# Altium schematic sheet ATMEGA32U4+Micro+Ver1.0.schdoc
size 305 x 221 mm
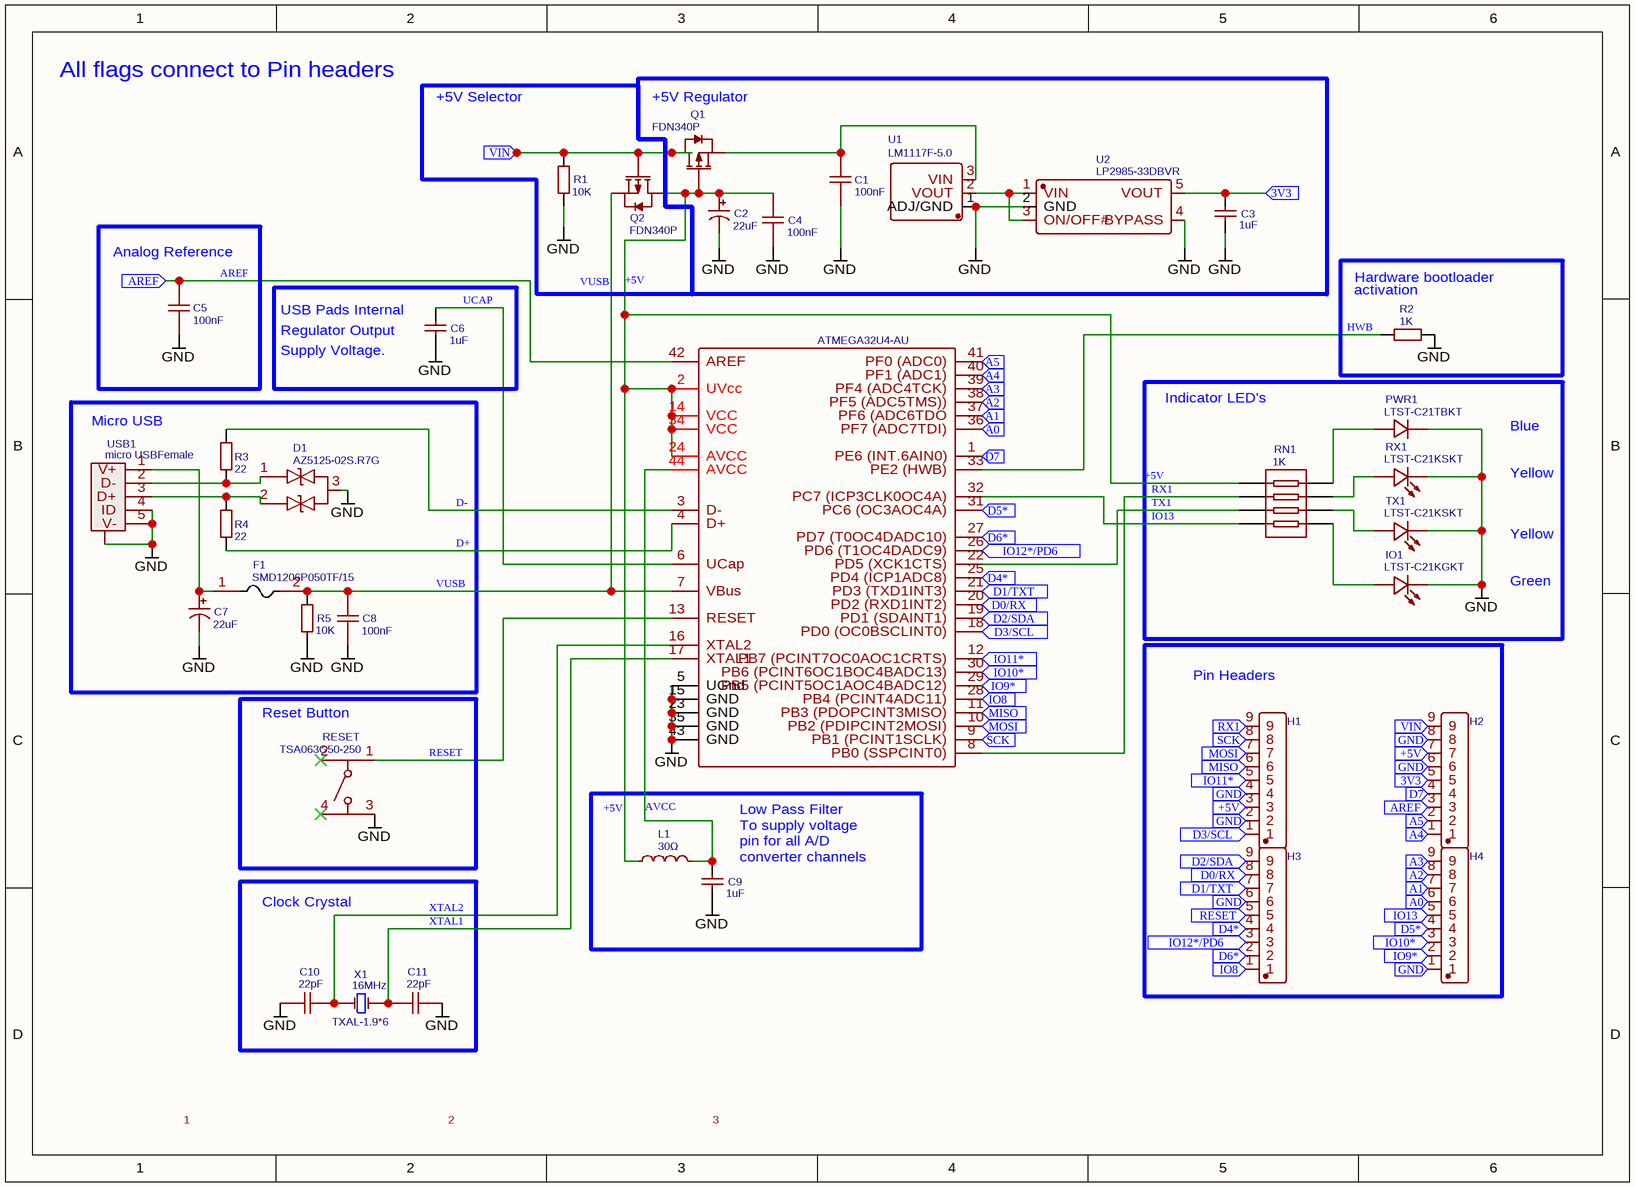
[diagram p0: ATMEGA32U4+Micro+Ver1.0.schdoc]

## Parts
ATMEGA1U4-AU  ATMEGA32U4-AU  [QFP-44_10X10X08P]
C1  100nF  [0603]
C2  22uF  [CAP-SMD_BD5.0-L5.3-W5.3-FD]
C3  1uF  [0603]
C4  100nF  [0603]
C5  100nF  [0603]
C6  1uF  [0603]
C7  22uF  [CAP-SMD_BD5.0-L5.3-W5.3-FD]
C8  100nF  [0603]
C9  1uF  [0603]
C10  22pF  [0805]
C11  22pF  [0805]
D1  AZ5125-02S.R7G  [SOT-23-3_L2.9-W1.6-P1.90-LS2.8-BR]
F1  SMD1206P050TF/15  [FUSE-1206]
H1  A2541WV-9P  [SIP-2.54MM-9P-CJT-H8.54]  (value not drawn)
H2  A2541WV-9P  [SIP-2.54MM-9P-CJT-H8.54]  (value not drawn)
H3  A2541WV-9P  [SIP-2.54MM-9P-CJT-H8.54]  (value not drawn)
H4  A2541WV-9P  [SIP-2.54MM-9P-CJT-H8.54]  (value not drawn)
IO1  LTST-C21KGKT  [LED-SMD-3.2X1.6X1.1]
L1  30Ω  [0805]
PWR1  LTST-C21TBKT  [LED-SMD-3.2X1.6X1.1]
Q1  FDN340P  [SOT-23-3_L2.9-W1.6-P1.90-LS2.8-BR]
Q2  FDN340P  [SOT-23-3_L2.9-W1.6-P1.90-LS2.8-BR]
R1  10K  [0805]
R2  1K  [0805]
R3  22  [0805]
R4  22  [0805]
R5  10K  [0805]
RESET  TSA063G50-250  [SW-SMD-T6X6-9.5X5.8]
RN1  1K  [1206_X4]
RX1  LTST-C21KSKT  [LED-SMD-3.2X1.6X1.1]
TX1  LTST-C21KSKT  [LED-SMD-3.2X1.6X1.1]
U1  LM1117F-5.0  [SOT-89(SOT-89-3)]
U2  LP2985-33DBVR  [SOT-23-5]
USB1  micro USBFemale  [MICRO-USB-1]
X1  16MHz  [TXAL-1.9*6]

## Blocks framed on the sheet
+5V Selector: Q2 R1
+5V Regulator: C1-C4 Q1 U1 U2
Analog Reference: C5
Micro USB: C7 C8 D1 F1 R3-R5 USB1
Pin Headers: H1-H4
Reset Button: RESET
Clock Crystal: C10 C11 X1

## Ports
3V3, +5V, A0, A1, A2, A3, A4, A5, AREF, D0/RX, D1/TXT, D2/SDA, D3/SCL, D4*, D5*, D6*, D7, GND, IO8, IO9*, IO10*, IO11*, IO12*/PD6, IO13, MISO, MOSI, RESET, RX1, SCK, VIN

## Nets
GND: ATMEGA1U4-AU.5(UGnd) ATMEGA1U4-AU.15(GND) ATMEGA1U4-AU.23(GND) ATMEGA1U4-AU.35(GND) ATMEGA1U4-AU.43(GND) C1.1 C2.2 C3.1 C4.1 C5.1 C6.1 C7.2 C8.1 C9.1 C10.1 C11.2 D1.3 IO1.1(C) PWR1.2(-) R1.1 R2.1 R5.1 RESET.3 RX1.1(C) TX1.1(C) U1.1(ADJ/GND) U2.2(GND) U2.4(BYPASS) USB1.0(MTN) USB1.4(ID) USB1.5(V-)
3V3: C3.2 H2.5 U2.5(VOUT) ; port 3V3
+5V: ATMEGA1U4-AU.2(UVcc) ATMEGA1U4-AU.14(VCC) ATMEGA1U4-AU.24(AVCC) ATMEGA1U4-AU.34(VCC) C2.1 C4.2 L1.1 Q1.1(G) Q2.3(D) RN1.5
+5V: H1.3 H2.7 ; port +5V  [a separate net that carries the same name]
A0: ATMEGA1U4-AU.36(PF7_(ADC7TDI)) H4.6 ; port A0
A1: ATMEGA1U4-AU.37(PF6_(ADC6TDO) H4.7 ; port A1
A2: ATMEGA1U4-AU.38(PF5_(ADC5TMS))) H4.8 ; port A2
A3: ATMEGA1U4-AU.39(PF4_(ADC4TCK)) H4.9 ; port A3
A4: ATMEGA1U4-AU.40(PF1_(ADC1)) H2.1 ; port A4
A5: ATMEGA1U4-AU.41(PF0_(ADC0)) H2.2 ; port A5
AREF: ATMEGA1U4-AU.42(AREF) C5.2 H2.3 ; port AREF
AVCC: ATMEGA1U4-AU.44(AVCC) C9.2 L1.2
D0/RX: ATMEGA1U4-AU.20(PD2_(RXD1INT2)) H3.8 ; port D0/RX
D1/TXT: ATMEGA1U4-AU.21(PD3_(TXD1INT3)) H3.7 ; port D1/TXT
D2/SDA: ATMEGA1U4-AU.19(PD1_(SDAINT1)) H3.9 ; port D2/SDA
D3/SCL: ATMEGA1U4-AU.18(PD0_(OC0BSCLINT0)) H1.1 ; port D3/SCL
D4*: ATMEGA1U4-AU.25(PD4_(ICP1ADC8)) H3.4 ; port D4*
D5*: ATMEGA1U4-AU.31(PC6_(OC3AOC4A)) H4.4 ; port D5*
D6*: ATMEGA1U4-AU.27(PD7_(T0OC4DADC10)) H3.2 ; port D6*
D7: ATMEGA1U4-AU.1(PE6_(INT.6AIN0)) H2.4 ; port D7
D+: ATMEGA1U4-AU.4(D+) R4.2
D-: ATMEGA1U4-AU.3(D-) R3.2
GND: H1.2 H1.4 H2.6 H2.8 H3.6 H4.1 ; port GND  [a separate net that carries the same name]
HWB: ATMEGA1U4-AU.33(PE2_(HWB)) R2.2
IO8: ATMEGA1U4-AU.28(PB4_(PCINT4ADC11)) H3.1 ; port IO8
IO9*: ATMEGA1U4-AU.29(PB5_(PCINT5OC1AOC4BADC12)) H4.2 ; port IO9*
IO10*: ATMEGA1U4-AU.30(PB6_(PCINT6OC1BOC4BADC13)) H4.3 ; port IO10*
IO11*: ATMEGA1U4-AU.12(PB7_(PCINT7OC0AOC1CRTS)) H1.5 ; port IO11*
IO12*/PD6: ATMEGA1U4-AU.26(PD6_(T1OC4DADC9)) H3.3 ; port IO12*/PD6
IO13: ATMEGA1U4-AU.32(PC7_(ICP3CLK0OC4A)) RN1.8
IO13: H4.5 ; port IO13  [a separate net that carries the same name]
MISO: ATMEGA1U4-AU.11(PB3_(PDOPCINT3MISO)) H1.6 ; port MISO
MOSI: ATMEGA1U4-AU.10(PB2_(PDIPCINT2MOSI)) H1.7 ; port MOSI
RESET: ATMEGA1U4-AU.13(RESET) RESET.1
RESET: H3.5 ; port RESET  [a separate net that carries the same name]
RX1: ATMEGA1U4-AU.8(PB0_(SSPCINT0)) RN1.6
RX1: H1.9 ; port RX1  [a separate net that carries the same name]
SCK: ATMEGA1U4-AU.9(PB1_(PCINT1SCLK)) H1.8 ; port SCK
TX1: ATMEGA1U4-AU.22(PD5_(XCK1CTS)) RN1.7
UCAP: ATMEGA1U4-AU.6(UCap) C6.2
VIN: H2.9 Q1.3(D) Q2.1(G) R1.2 ; port VIN
VUSB: ATMEGA1U4-AU.7(VBus) C8.2 F1.2 Q2.2(S) R5.2
XTAL1: ATMEGA1U4-AU.17(XTAL1) C11.1 X1.2(OSC2)
XTAL2: ATMEGA1U4-AU.16(XTAL2) C10.2 X1.1(OSC1)
NetC1_2: C1.2 Q1.2(S) U1.3(VIN)
NetC7_1: C7.1 F1.1 USB1.1(V+)
NetD1_1: D1.1 R3.1 USB1.2(D-)
NetD1_2: D1.2 R4.1 USB1.3(D+)
NetIO1_2: IO1.2(A) RN1.1
NetPWR1_1: PWR1.1(+) RN1.4
NetRN1_2: RN1.2 TX1.2(A)
NetRN1_3: RN1.3 RX1.2(A)
NetU1_2: U1.2(VOUT) U2.1(VIN) U2.3(ON/OFF#)

Not connected (* = marked no-connect by the designer): RESET 2* 4*

## Notes on the sheet
- All flags connect to Pin headers
- (near C6) USB Pads Internal
- (near R2) activation
- (near R2) Hardware bootloader
- (near C6) Regulator Output
- Supply Voltage.
- Indicator LED's
- Blue
- Yellow
- Green
- Low Pass Filter
- To supply voltage
- pin for all A/D
- (near C9) converter channels
- 1
- 2
- 3
- (in symbol 16MHz) TXAL-1.9*6

## Library data of the parts
ATMEGA1U4-AU = ATMEGA32U4-AU: BOM_Manufacturer: MICROCHIP; SMT Type: Extend; BOM_Supplier: LCSC; BOM_Manufacturer Part: ATMEGA32U4-AU; image: //image.lceda.cn/szlcsc/C44854.jpg; BOM_Supplier Part: C44854; BOM_LCSC Assembly: Yes; spicePre: U
C1 C4 C5 C8 = 100nF: BOM_Manufacturer: FH; BOM_Manufacturer Part: 0603B104J500NT; nameAlias: Capacitance; BOM_Supplier: LCSC; BOM_Supplier Part: C88136; spicePre: C; spiceSymbolName: 0603B104J500NT
C2 C7 = 22uF: BOM_Manufacturer: HONOR; BOM_Manufacturer Part: RVT1V220M0505; nameAlias: Capacitance; BOM_Supplier: LCSC; BOM_Supplier Part: C23289; spicePre: C; spiceSymbolName: RVT1V220M0505-C23289
C3 C6 C9 = 1uF: BOM_Manufacturer Part: CL10A105KP8NNNC; BOM_Manufacturer: SAMSUNG; nameAlias: Capacitance; BOM_Supplier: LCSC; BOM_Supplier Part: C26413; spicePre: C; spiceSymbolName: CL10A105KP8NNNC
C10 C11 = 22pF: BOM_Manufacturer: FH; BOM_Manufacturer Part: 0805CG220J500NT; nameAlias: Capacitance; BOM_Supplier: LCSC; BOM_Supplier Part: C24658; spicePre: C; spiceSymbolName: 0805CG220J500NT
D1 = AZ5125-02S.R7G: BOM_Manufacturer: AMAZING; Contributor: LCSC; BOM_Supplier: LCSC; BOM_Supplier Part: C356820; BOM_Manufacturer Part: AZ5125-02S.R7G; spicePre: D
F1 = SMD1206P050TF/15: BOM_Manufacturer: PTTC; BOM_Supplier: LCSC; BOM_Manufacturer Part: SMD1206P050TF/15; BOM_Supplier Part: C106264; spicePre: F
H1-H4 = A2541WV-9P: BOM_Manufacturer: Changjiang Connectors; Contributor: LCSC; BOM_Supplier: LCSC; BOM_Supplier Part: C225484; BOM_Manufacturer Part: A2541WV-9P; spicePre: H
IO1 = LTST-C21KGKT: BOM_Manufacturer: Lite-On; Contributor: LCSC; BOM_Supplier: LCSC; BOM_Supplier Part: C284938; BOM_Manufacturer Part: LTST-C21KGKT; spicePre: L
L1 = 30Ω: BOM_Manufacturer: ReliaPro; BOM_Manufacturer Part: MLB2012-300P3A(f); nameAlias: Value; BOM_Supplier: LCSC; BOM_Supplier Part: C50503; spicePre: L; spiceSymbolName: MLB2012-300P3A(f)
PWR1 = LTST-C21TBKT: BOM_Manufacturer: Lite-On; Contributor: LCSC; BOM_Supplier: LCSC; BOM_Supplier Part: C284941; BOM_Manufacturer Part: LTST-C21TBKT; spicePre: L
Q1 Q2 = FDN340P: BOM_Manufacturer: FAIRCHILD; SMT Type: Extend; BOM_Supplier: LCSC; BOM_Manufacturer Part: FDN340P; BOM_Supplier Part: C75469; BOM_LCSC Assembly: Yes; spicePre: Q
R1 R5 = 10K: BOM_Manufacturer: YAGEO; BOM_Manufacturer Part: RC0805FR-0710KL; nameAlias: Resistance (Ohms); BOM_Supplier: LCSC; BOM_Supplier Part: C84376; spicePre: R; spiceSymbolName: RC0805FR-0710KL
R2 = 1K: BOM_Manufacturer: UniOhm; BOM_Manufacturer Part: 0805W8F1001T5E; nameAlias: Resistance (Ohms); SMT Type: Basic; BOM_Supplier: LCSC; BOM_LCSC Assembly: Yes; BOM_Supplier Part: C17513; spicePre: R; spiceSymbolName: 0805W8F1001T5E
R3 R4 = 22: BOM_Manufacturer: UniOhm; BOM_Manufacturer Part: 0805W8J0220T5E; nameAlias: Resistance (Ohms); BOM_Supplier: LCSC; BOM_Supplier Part: C25295; spicePre: R; spiceSymbolName: 0805W8J0220T5E
RESET = TSA063G50-250: BOM_Manufacturer: BRIGHT; Contributor: LCSC; BOM_Supplier: LCSC; BOM_Supplier Part: C294565; BOM_Manufacturer Part: TSA063G50-250; spicePre: S
RN1 = 1K: BOM_Manufacturer: EVER OHMS; BOM_Manufacturer Part: CRA064RJ1KE04; nameAlias: Resistance (Ohms); Contributor: LCSC; BOM_Supplier: LCSC; BOM_Supplier Part: C149873; spicePre: R; spiceSymbolName: CRA064RJ1KE04
RX1 TX1 = LTST-C21KSKT: BOM_Manufacturer: Lite-On; Contributor: LCSC; BOM_Supplier: LCSC; BOM_Supplier Part: C284940; BOM_Manufacturer Part: LTST-C21KSKT; spicePre: L
U1 = LM1117F-5.0: BOM_Manufacturer: HTC; Contributor: LCSC; SMT Type: Extend; BOM_Supplier: LCSC; BOM_Manufacturer Part: LM1117F-5.0; BOM_Supplier Part: C126020; BOM_LCSC Assembly: Yes; spicePre: U
U2 = LP2985-33DBVR: BOM_Manufacturer: TI; SMT Type: Extend; BOM_Supplier: LCSC; BOM_Manufacturer Part: LP2985-33DBVR; BOM_Supplier Part: C95414; BOM_LCSC Assembly: Yes; spicePre: U
USB1 = micro USBFemale: BOM_Manufacturer: ValuePro; BOM_Supplier: LCSC; BOM_Manufacturer Part: micro USBFemale; image: //image.lceda.cn/szlcsc/C10418.jpg; BOM_Supplier Part: C10418; spicePre: U
X1 = 16MHz: BOM_Manufacturer Part: X206016MSD2SC; BOM_Manufacturer: YXC; nameAlias: Frequency; Package Display: Yes; BOM_Supplier: LCSC; BOM_Supplier Part: C2174; spicePre: X; spiceSymbolName: X206016MSD2SC